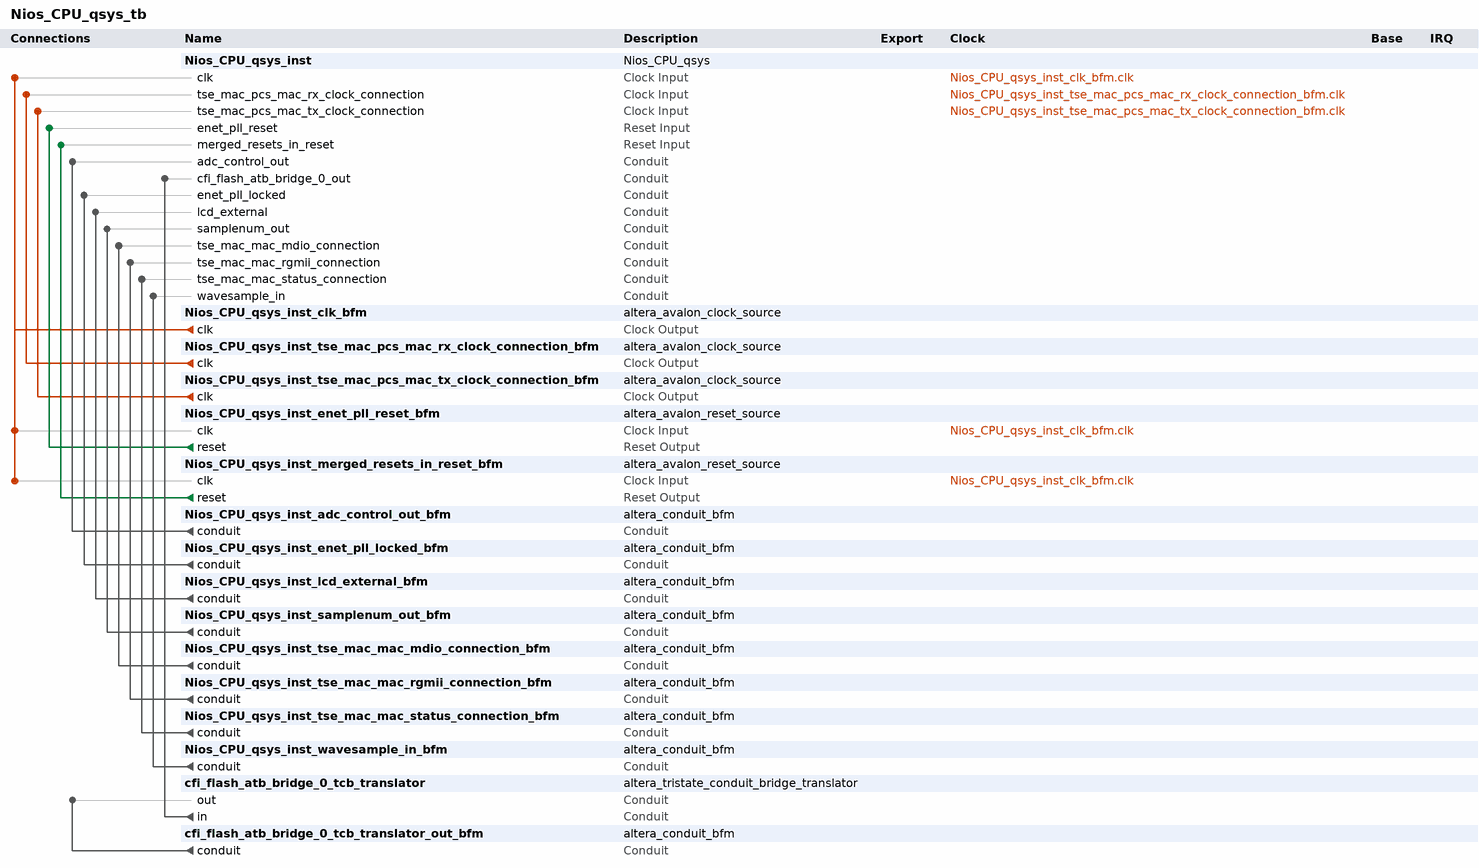
[diagram p0: system contents]
# Platform Designer (Qsys) system Nios_CPU_qsys_tb, Arria V 5AGXFB3H4F35C4
# Parameters at their usual value, and those the tool derives, are not listed.
package require -exact qsys 16.1
create_system Nios_CPU_qsys_tb
set_project_property DEVICE_FAMILY {Arria V}
set_project_property DEVICE 5AGXFB3H4F35C4

add_instance Nios_CPU_qsys_inst Nios_CPU_qsys 1.0

add_instance Nios_CPU_qsys_inst_clk_bfm altera_avalon_clock_source 16.1

add_instance Nios_CPU_qsys_inst_tse_mac_pcs_mac_rx_clock_connection_bfm altera_avalon_clock_source 16.1

add_instance Nios_CPU_qsys_inst_tse_mac_pcs_mac_tx_clock_connection_bfm altera_avalon_clock_source 16.1

add_instance Nios_CPU_qsys_inst_enet_pll_reset_bfm altera_avalon_reset_source 16.1
set_instance_parameter_value Nios_CPU_qsys_inst_enet_pll_reset_bfm ASSERT_HIGH_RESET 1
set_instance_parameter_value Nios_CPU_qsys_inst_enet_pll_reset_bfm INITIAL_RESET_CYCLES 50

add_instance Nios_CPU_qsys_inst_merged_resets_in_reset_bfm altera_avalon_reset_source 16.1
set_instance_parameter_value Nios_CPU_qsys_inst_merged_resets_in_reset_bfm ASSERT_HIGH_RESET 0
set_instance_parameter_value Nios_CPU_qsys_inst_merged_resets_in_reset_bfm INITIAL_RESET_CYCLES 50

add_instance Nios_CPU_qsys_inst_adc_control_out_bfm altera_conduit_bfm 16.1
set_instance_parameter_value Nios_CPU_qsys_inst_adc_control_out_bfm CLOCKED_SIGNAL false
set_instance_parameter_value Nios_CPU_qsys_inst_adc_control_out_bfm ENABLE_RESET false
set_instance_parameter_value Nios_CPU_qsys_inst_adc_control_out_bfm SIGNAL_DIRECTIONS input
set_instance_parameter_value Nios_CPU_qsys_inst_adc_control_out_bfm SIGNAL_WIDTHS 8

add_instance Nios_CPU_qsys_inst_enet_pll_locked_bfm altera_conduit_bfm 16.1
set_instance_parameter_value Nios_CPU_qsys_inst_enet_pll_locked_bfm CLOCKED_SIGNAL false
set_instance_parameter_value Nios_CPU_qsys_inst_enet_pll_locked_bfm ENABLE_RESET false
set_instance_parameter_value Nios_CPU_qsys_inst_enet_pll_locked_bfm SIGNAL_DIRECTIONS input
set_instance_parameter_value Nios_CPU_qsys_inst_enet_pll_locked_bfm SIGNAL_WIDTHS 1

add_instance Nios_CPU_qsys_inst_lcd_external_bfm altera_conduit_bfm 16.1
set_instance_parameter_value Nios_CPU_qsys_inst_lcd_external_bfm CLOCKED_SIGNAL false
set_instance_parameter_value Nios_CPU_qsys_inst_lcd_external_bfm ENABLE_RESET false
set_instance_parameter_value Nios_CPU_qsys_inst_lcd_external_bfm SIGNAL_DIRECTIONS input,input,bidir,input
set_instance_parameter_value Nios_CPU_qsys_inst_lcd_external_bfm SIGNAL_ROLES RS,RW,data,E
set_instance_parameter_value Nios_CPU_qsys_inst_lcd_external_bfm SIGNAL_WIDTHS 1,1,8,1

add_instance Nios_CPU_qsys_inst_samplenum_out_bfm altera_conduit_bfm 16.1
set_instance_parameter_value Nios_CPU_qsys_inst_samplenum_out_bfm CLOCKED_SIGNAL false
set_instance_parameter_value Nios_CPU_qsys_inst_samplenum_out_bfm ENABLE_RESET false
set_instance_parameter_value Nios_CPU_qsys_inst_samplenum_out_bfm SIGNAL_DIRECTIONS input
set_instance_parameter_value Nios_CPU_qsys_inst_samplenum_out_bfm SIGNAL_WIDTHS 16

add_instance Nios_CPU_qsys_inst_tse_mac_mac_mdio_connection_bfm altera_conduit_bfm 16.1
set_instance_parameter_value Nios_CPU_qsys_inst_tse_mac_mac_mdio_connection_bfm CLOCKED_SIGNAL false
set_instance_parameter_value Nios_CPU_qsys_inst_tse_mac_mac_mdio_connection_bfm ENABLE_RESET false
set_instance_parameter_value Nios_CPU_qsys_inst_tse_mac_mac_mdio_connection_bfm SIGNAL_DIRECTIONS input,output,input,input
set_instance_parameter_value Nios_CPU_qsys_inst_tse_mac_mac_mdio_connection_bfm SIGNAL_ROLES mdc,mdio_in,mdio_out,mdio_oen
set_instance_parameter_value Nios_CPU_qsys_inst_tse_mac_mac_mdio_connection_bfm SIGNAL_WIDTHS 1,1,1,1

add_instance Nios_CPU_qsys_inst_tse_mac_mac_rgmii_connection_bfm altera_conduit_bfm 16.1
set_instance_parameter_value Nios_CPU_qsys_inst_tse_mac_mac_rgmii_connection_bfm CLOCKED_SIGNAL false
set_instance_parameter_value Nios_CPU_qsys_inst_tse_mac_mac_rgmii_connection_bfm ENABLE_RESET false
set_instance_parameter_value Nios_CPU_qsys_inst_tse_mac_mac_rgmii_connection_bfm SIGNAL_DIRECTIONS output,input,output,input
set_instance_parameter_value Nios_CPU_qsys_inst_tse_mac_mac_rgmii_connection_bfm SIGNAL_ROLES rgmii_in,rgmii_out,rx_control,tx_control
set_instance_parameter_value Nios_CPU_qsys_inst_tse_mac_mac_rgmii_connection_bfm SIGNAL_WIDTHS 4,4,1,1

add_instance Nios_CPU_qsys_inst_tse_mac_mac_status_connection_bfm altera_conduit_bfm 16.1
set_instance_parameter_value Nios_CPU_qsys_inst_tse_mac_mac_status_connection_bfm CLOCKED_SIGNAL false
set_instance_parameter_value Nios_CPU_qsys_inst_tse_mac_mac_status_connection_bfm ENABLE_RESET false
set_instance_parameter_value Nios_CPU_qsys_inst_tse_mac_mac_status_connection_bfm SIGNAL_DIRECTIONS output,output,input,input
set_instance_parameter_value Nios_CPU_qsys_inst_tse_mac_mac_status_connection_bfm SIGNAL_ROLES set_10,set_1000,eth_mode,ena_10
set_instance_parameter_value Nios_CPU_qsys_inst_tse_mac_mac_status_connection_bfm SIGNAL_WIDTHS 1,1,1,1

add_instance Nios_CPU_qsys_inst_wavesample_in_bfm altera_conduit_bfm 16.1
set_instance_parameter_value Nios_CPU_qsys_inst_wavesample_in_bfm CLOCKED_SIGNAL false
set_instance_parameter_value Nios_CPU_qsys_inst_wavesample_in_bfm ENABLE_RESET false
set_instance_parameter_value Nios_CPU_qsys_inst_wavesample_in_bfm SIGNAL_DIRECTIONS output
set_instance_parameter_value Nios_CPU_qsys_inst_wavesample_in_bfm SIGNAL_WIDTHS 16

add_instance cfi_flash_atb_bridge_0_tcb_translator altera_tristate_conduit_bridge_translator 16.1
set_instance_parameter_value cfi_flash_atb_bridge_0_tcb_translator CHAIN_LENGTH 4
set_instance_parameter_value cfi_flash_atb_bridge_0_tcb_translator MODULE_ORIGIN_LIST ext_flash.tcm,ext_flash.tcm,ext_flash.tcm,ext_flash.tcm,ext_flash.tcm
set_instance_parameter_value cfi_flash_atb_bridge_0_tcb_translator SIGNAL_ORIGIN_LIST tcm_address_out,tcm_read_n_out,tcm_write_n_out,tcm_data_out,tcm_chipselect_n_out
set_instance_parameter_value cfi_flash_atb_bridge_0_tcb_translator SIGNAL_ORIGIN_TYPE Output,Output,Output,Bidirectional,Output
set_instance_parameter_value cfi_flash_atb_bridge_0_tcb_translator SIGNAL_ORIGIN_WIDTH 27,1,1,16,1

add_instance cfi_flash_atb_bridge_0_tcb_translator_out_bfm altera_conduit_bfm 16.1
set_instance_parameter_value cfi_flash_atb_bridge_0_tcb_translator_out_bfm CLOCKED_SIGNAL false
set_instance_parameter_value cfi_flash_atb_bridge_0_tcb_translator_out_bfm ENABLE_RESET false
set_instance_parameter_value cfi_flash_atb_bridge_0_tcb_translator_out_bfm SIGNAL_DIRECTIONS input,input,input,bidir,input
set_instance_parameter_value cfi_flash_atb_bridge_0_tcb_translator_out_bfm SIGNAL_ROLES tcm_address_out,tcm_read_n_out,tcm_write_n_out,tcm_data_out,tcm_chipselect_n_out
set_instance_parameter_value cfi_flash_atb_bridge_0_tcb_translator_out_bfm SIGNAL_WIDTHS 27,1,1,16,1

# connections
add_connection Nios_CPU_qsys_inst_clk_bfm.clk Nios_CPU_qsys_inst.clk clock
add_connection Nios_CPU_qsys_inst_clk_bfm.clk Nios_CPU_qsys_inst_enet_pll_reset_bfm.clk clock
add_connection Nios_CPU_qsys_inst_clk_bfm.clk Nios_CPU_qsys_inst_merged_resets_in_reset_bfm.clk clock
add_connection Nios_CPU_qsys_inst_tse_mac_pcs_mac_rx_clock_connection_bfm.clk Nios_CPU_qsys_inst.tse_mac_pcs_mac_rx_clock_connection clock
add_connection Nios_CPU_qsys_inst_tse_mac_pcs_mac_tx_clock_connection_bfm.clk Nios_CPU_qsys_inst.tse_mac_pcs_mac_tx_clock_connection clock
add_connection Nios_CPU_qsys_inst_enet_pll_reset_bfm.reset Nios_CPU_qsys_inst.enet_pll_reset reset
add_connection Nios_CPU_qsys_inst_merged_resets_in_reset_bfm.reset Nios_CPU_qsys_inst.merged_resets_in_reset reset
add_connection cfi_flash_atb_bridge_0_tcb_translator.in Nios_CPU_qsys_inst.cfi_flash_atb_bridge_0_out conduit
add_connection cfi_flash_atb_bridge_0_tcb_translator_out_bfm.conduit cfi_flash_atb_bridge_0_tcb_translator.out conduit
add_connection Nios_CPU_qsys_inst_adc_control_out_bfm.conduit Nios_CPU_qsys_inst.adc_control_out conduit
add_connection Nios_CPU_qsys_inst_enet_pll_locked_bfm.conduit Nios_CPU_qsys_inst.enet_pll_locked conduit
add_connection Nios_CPU_qsys_inst_lcd_external_bfm.conduit Nios_CPU_qsys_inst.lcd_external conduit
add_connection Nios_CPU_qsys_inst_samplenum_out_bfm.conduit Nios_CPU_qsys_inst.samplenum_out conduit
add_connection Nios_CPU_qsys_inst_tse_mac_mac_mdio_connection_bfm.conduit Nios_CPU_qsys_inst.tse_mac_mac_mdio_connection conduit
add_connection Nios_CPU_qsys_inst_tse_mac_mac_rgmii_connection_bfm.conduit Nios_CPU_qsys_inst.tse_mac_mac_rgmii_connection conduit
add_connection Nios_CPU_qsys_inst_tse_mac_mac_status_connection_bfm.conduit Nios_CPU_qsys_inst.tse_mac_mac_status_connection conduit
add_connection Nios_CPU_qsys_inst_wavesample_in_bfm.conduit Nios_CPU_qsys_inst.wavesample_in conduit

set_interconnect_requirement {$system} qsys_mm.clockCrossingAdapter HANDSHAKE
set_interconnect_requirement {$system} qsys_mm.enableEccProtection FALSE
set_interconnect_requirement {$system} qsys_mm.insertDefaultSlave FALSE
set_interconnect_requirement {$system} qsys_mm.maxAdditionalLatency 1

save_system Nios_CPU_qsys_tb.qsys
